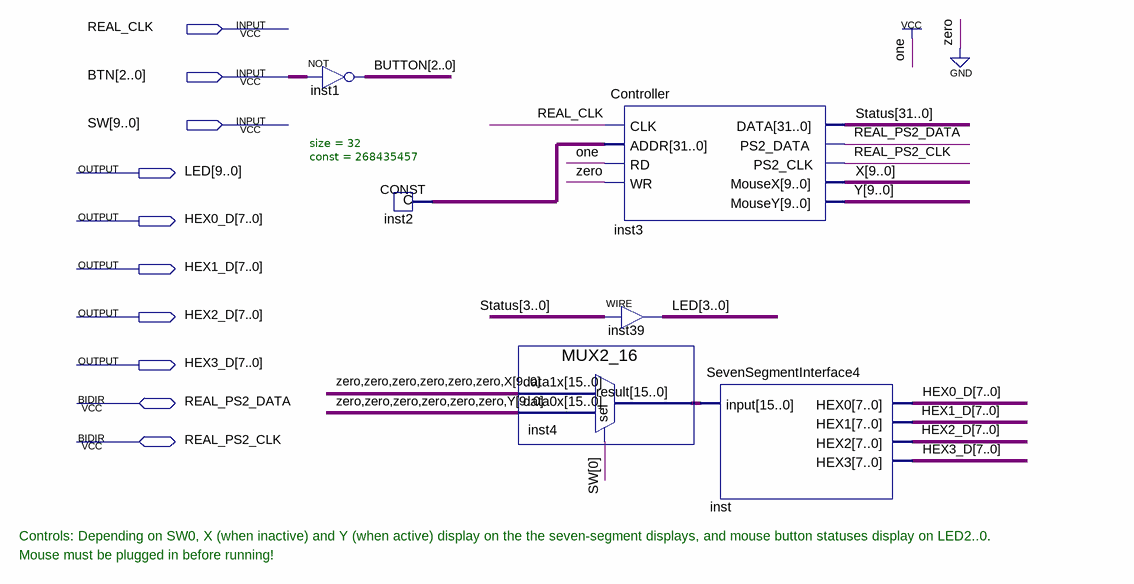
[diagram p0: schematic sheet]
// Quartus schematic ControllerTest.bdf as structural Verilog: 6 symbols, 10 pins
module ControllerTest (
  input  REAL_CLK,
  input  [2:0] BTN,
  input  [9:0] SW,
  inout  REAL_PS2_DATA,
  inout  REAL_PS2_CLK,
  output [9:0] LED,
  output [7:0] HEX0_D,
  output [7:0] HEX1_D,
  output [7:0] HEX2_D,
  output [7:0] HEX3_D
);

  wire [2:0] BUTTON;
  wire [9:0] X, Y;
  wire [15:0] inst4_result;
  wire [31:0] inst2_data, Status;

  assign BUTTON = ~BTN;  // NOT inst1, 3 bits wide
  CONST #(.size(32), .\const (268435457)) inst2 (.data(inst2_data));
  MUX2_16 inst4 (.data1x({{6{1'b0}}, X}), .data0x({{6{1'b0}}, Y}), .sel(SW[0]), .result(inst4_result));
  Controller inst3 (
    .CLK(REAL_CLK), .ADDR(inst2_data), .RD(1'b1), .WR(1'b0), .MouseX(X), .MouseY(Y), .DATA(Status),
    .PS2_DATA(REAL_PS2_DATA), .PS2_CLK(REAL_PS2_CLK));
  assign LED[3:0] = Status[3:0];  // WIRE inst39
  SevenSegmentInterface4 inst (.\input (inst4_result), .HEX0(HEX0_D), .HEX1(HEX1_D), .HEX2(HEX2_D), .HEX3(HEX3_D));

  // Notes on the sheet:
  //   Controls: Depending on SW0, X (when inactive) and Y (when active) display on the the seven-segment displays, and mouse button statuses display on LED2..0.
  //   Mouse must be plugged in before running!
endmodule
